# Altium schematic sheet lora-core.SchDoc
size A4; SheetNumber: 1; SheetTotal: 5
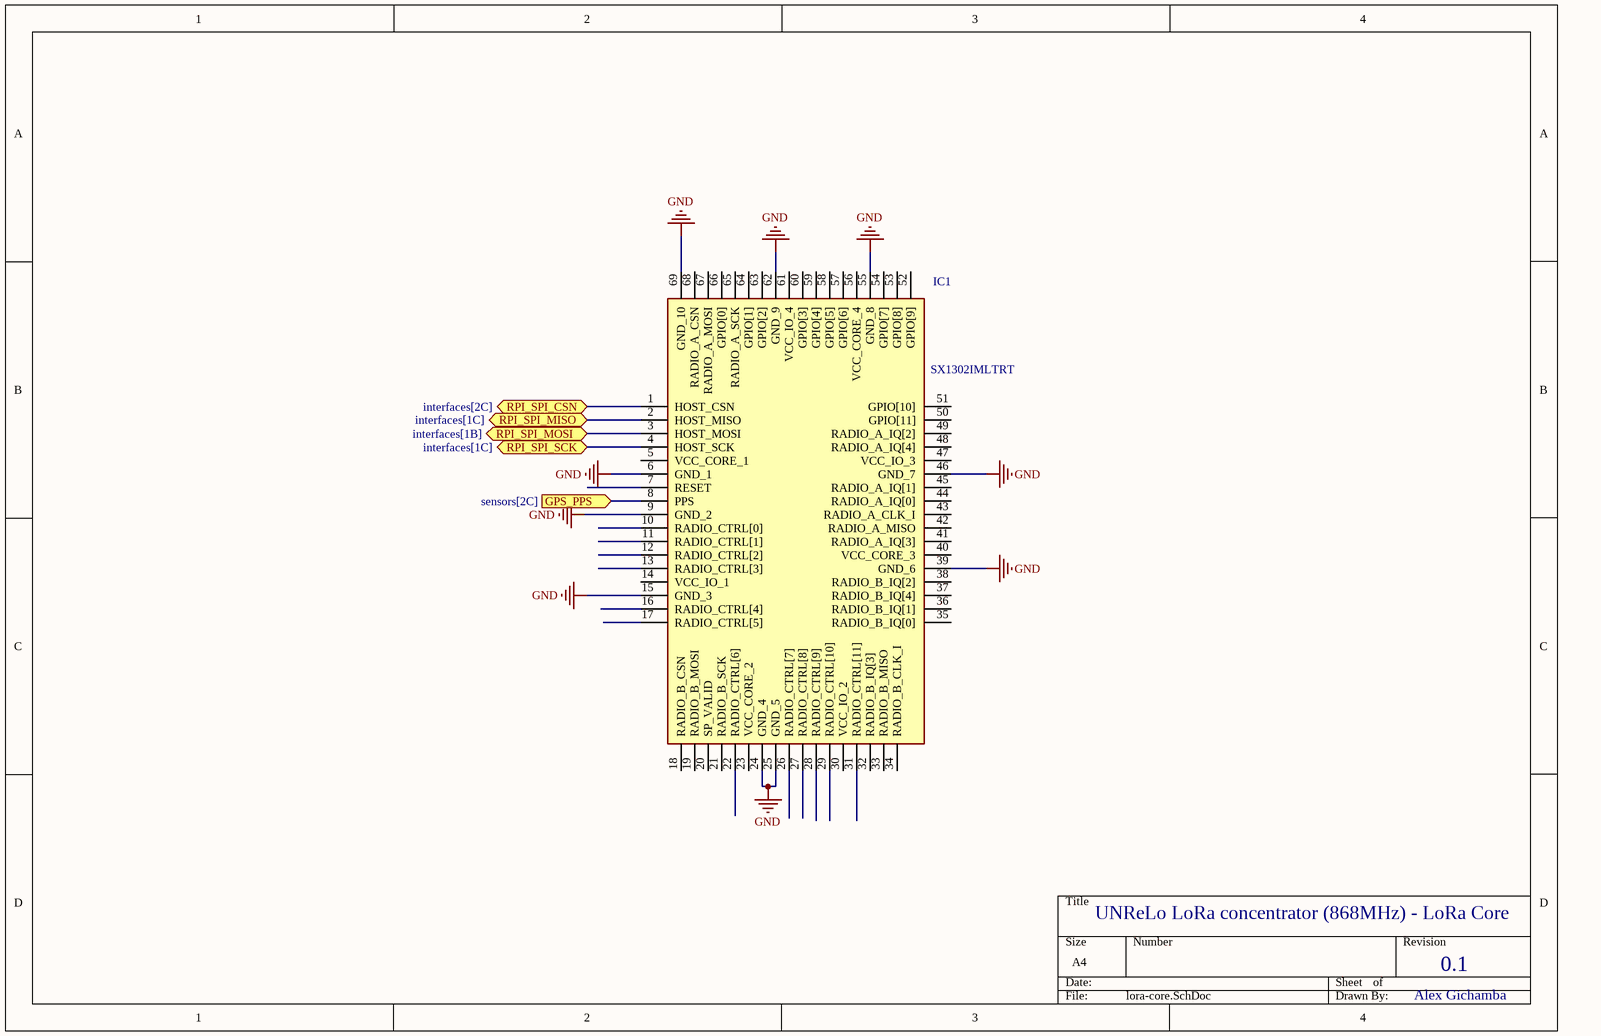
[diagram p0: lora-core.SchDoc]

## Parts
IC1  SX1302IMLTRT  [QFN35P700X700X80-69N-D]

## Ports
GPS_PPS (in, see sensors[2C]), RPI_SPI_CSN (bidir, see interfaces[2C]), RPI_SPI_MISO (bidir, see interfaces[1C]), RPI_SPI_MOSI (bidir, see interfaces[1B]), RPI_SPI_SCK (bidir, see interfaces[1C])

## Nets
GND: IC1.6(GND_1) IC1.9(GND_2) IC1.15(GND_3) IC1.24(GND_4) IC1.25(GND_5) IC1.39(GND_6) IC1.46(GND_7) IC1.55(GND_8) IC1.62(GND_9) IC1.69(GND_10)
GPS_PPS: IC1.8(PPS) ; port GPS_PPS
RPI_SPI_CSN: IC1.1(HOST_CSN) ; port RPI_SPI_CSN
RPI_SPI_MISO: IC1.2(HOST_MISO) ; port RPI_SPI_MISO
RPI_SPI_MOSI: IC1.3(HOST_MOSI) ; port RPI_SPI_MOSI
RPI_SPI_SCK: IC1.4(HOST_SCK) ; port RPI_SPI_SCK

Not connected (* = marked no-connect by the designer): IC1 5(VCC_CORE_1) 7(RESET) 10(RADIO_CTRL[0]) 11(RADIO_CTRL[1]) 12(RADIO_CTRL[2]) 13(RADIO_CTRL[3]) 14(VCC_IO_1) 16(RADIO_CTRL[4]) 17(RADIO_CTRL[5]) 18(RADIO_B_CSN) 19(RADIO_B_MOSI) 20(SP_VALID) 21(RADIO_B_SCK) 22(RADIO_CTRL[6]) 23(VCC_CORE_2) 26(RADIO_CTRL[7]) 27(RADIO_CTRL[8]) 28(RADIO_CTRL[9]) 29(RADIO_CTRL[10]) 30(VCC_IO_2) 31(RADIO_CTRL[11]) 32(RADIO_B_IQ[3]) 33(RADIO_B_MISO) 34(RADIO_B_CLK_I) 35(RADIO_B_IQ[0]) 36(RADIO_B_IQ[1]) 37(RADIO_B_IQ[4]) 38(RADIO_B_IQ[2]) 40(VCC_CORE_3) 41(RADIO_A_IQ[3]) 42(RADIO_A_MISO) 43(RADIO_A_CLK_I) 44(RADIO_A_IQ[0]) 45(RADIO_A_IQ[1]) 47(VCC_IO_3) 48(RADIO_A_IQ[4]) 49(RADIO_A_IQ[2]) 50(GPIO[11]) 51(GPIO[10]) 52(GPIO[9]) 53(GPIO[8]) 54(GPIO[7]) 56(VCC_CORE_4) 57(GPIO[6]) 58(GPIO[5]) 59(GPIO[4]) 60(GPIO[3]) 61(VCC_IO_4) 63(GPIO[2]) 64(GPIO[1]) 65(RADIO_A_SCK) 66(GPIO[0]) 67(RADIO_A_MOSI) 68(RADIO_A_CSN)

## Notes on the sheet
- UNReLo LoRa concentrator (868MHz) - LoRa Core
- 0.1
- Alex Gichamba

## Library data of the parts
IC1 = SX1302IMLTRT: Integrated Circuit; Manufacturer_Name: SEMTECH; Datasheet Link: https://datasheet.datasheetarchive.com/originals/distributors/Datasheets_SAMA/c18cc298abe30af156b2783e16147acc.pdf; Height: 0.8mm; Manufacturer_Part_Number: SX1302IMLTRT; Mouser Part Number: 947-SX1302IMLTRT; Mouser Price/Stock: https://www.mouser.co.uk/ProductDetail/Semtech/SX1302IMLTRT?qs=bZr6mbWTK5nALa%252B96PTK0Q%3D%3D